# EAGLE design sous-vide-panel (EAGLE 7.6.0)
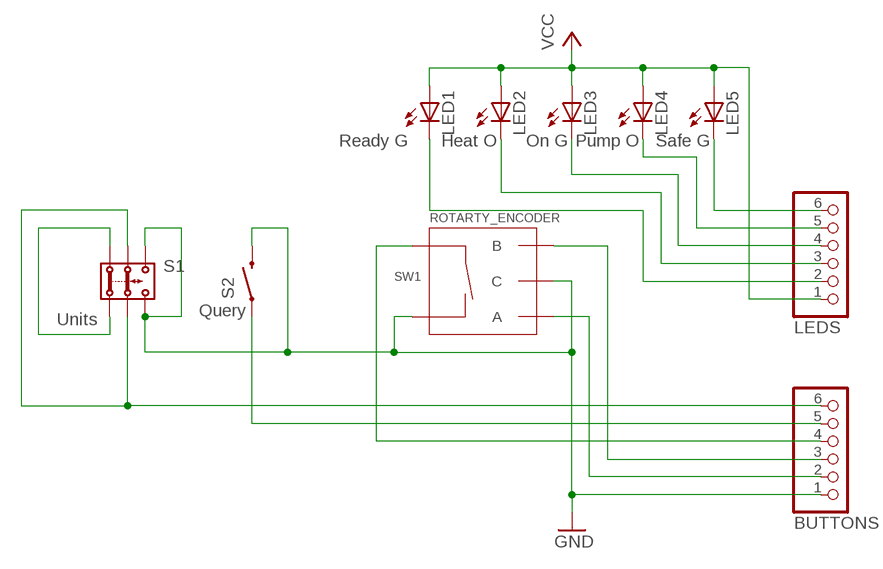
[diagram p0: schematic, sheet 1]

## Parts
BUTTONS  PINHD-1X6  [1X06]
LED1  Ready G  LED5MM  [LED5MM]
LED2  Heat O  LED5MM  [LED5MM]
LED3  On G  LED5MM  [LED5MM]
LED4  Pump O  LED5MM  [LED5MM]
LED5  Safe G  LED5MM  [LED5MM]
LEDS  PINHD-1X6  [1X06]
S1  Units  2P2T  [2P2T]
S2  Query  SWITCH-MOMENTARY-212MM  [TACTILE-PTH-12MM]
SW1  ROTARTY_ENCODER  [ROTARY_ENC_PLAIN]

## Nets
GND: BUTTONS.1 S1.3.1 S1.3.2 S2.3 SW1.C SW1.SW-
N$1: BUTTONS.6 S1.2.1 S1.2.2
N$2: BUTTONS.5 S2.1
N$3: BUTTONS.4 SW1.SW+
N$5: BUTTONS.3 SW1.B
N$6: LED5.K(C) LEDS.6
N$7: LED4.K(C) LEDS.5
N$8: BUTTONS.2 SW1.A
N$9: LED3.K(C) LEDS.4
N$10: LED2.K(C) LEDS.3
N$11: LED1.K(C) LEDS.2
N$13: S1.1.1 S1.1.2
VCC: LED1.A LED2.A LED3.A LED4.A LED5.A LEDS.1

## Library data of the parts
BUTTONS LEDS = pinhead:PINHD-1X6: PIN HEADER
LED1-LED5 = led:LED: LED OSRAM: - CHIPLED LG R971, LG N971, LY N971, LG Q971, LY Q971, LO R971, LY R971 LH N974, LH R974 LS Q976, LO Q976, LY Q976 LO Q996 - Hyper CHIPLED LW Q18S LB Q993, LB Q99A, LB R99A - SideLED LS A670, LO A670, LY A670, LG A670, LP A670 LB A673, LV A673, LT A673, LW A673 LH A674 LY A675 LS A676, LA A676, LO A676, LY A676, LW A676 LS A679, LY A679, LG A679 - Hyper Micro SIDELED® LS Y876, LA Y876, LO Y876, LY Y876 LT Y87S - SmartLED LW L88C, LW L88S LB L89C, LB L89S, LG L890 LS L89K, LO L89K, LY L89K LS L896, LA L896, LO L896, LY L896 - TOPLED LS T670, LO T670, LY T670, LG T670, LP T670 LSG T670, LSP T670, LSY T670, LOP T670, LYG T670 LG T671, LOG T671, LSG T671 LB T673, LV T673, LT T673, LW T673 LH T674 LS T676, LA T676, LO T676, LY T676, LB T676, LH T676, LSB T676, LW T676 LB T67C, LV T67C, LT T67C, LS T67K, LO T67K, LY T67K, LW E67C LS E67B, LA E67B, LO E67B, LY E67B, LB E67C, LV E67C, LT E67C LW T67C LS T679, LY T679, LG T679 LS T770, LO T770, LY T770, LG T770, LP T770 LB T773, LV T773, LT T773, LW T773 LH T774 LS E675, LA E675, LY E675, LS T675 LS T776, LA T776, LO T776, LY T776, LB T776 LHGB T686 LT T68C, LB T68C - Hyper Mini TOPLED® LB M676 - Mini TOPLED Santana® LG M470 LS M47K, LO M47K, LY M47K Source: http://www.osram.convergy.de LUXEON: - LUMILED® LXK2-PW12-R00, LXK2-PW12-S00, LXK2-PW14-U00, LXK2-PW14-V00 LXK2-PM12-R00, LXK2-PM12-S00, LXK2-PM14-U00 LXK2-PE12-Q00, LXK2-PE12-R00, LXK2-PE12-S00, LXK2-PE14-T00, LXK2-PE14-U00 LXK2-PB12-K00, LXK2-PB12-L00, LXK2-PB12-M00, LXK2-PB14-N00, LXK2-PB14-P00, LXK2-PB14-Q00 LXK2-PR12-L00, LXK2-PR12-M00, LXK2-PR14-Q00, LXK2-PR14-R00 LXK2-PD12-Q00, LXK2-PD12-R00, LXK2-PD12-S00 LXK2-PH12-R00, LXK2-PH12-S00 LXK2-PL12-P00, LXK2-PL12-Q00, LXK2-PL12-R00 Source: www.luxeon.com KINGBRIGHT: KA-3528ASYC Source: www.kingbright.com
S1 = switch:2P2T: SLIDE SWITCH 2P2T Part No. SS-22F05-G(A)4 Source: CANAL ELECTRONIC CO., LTD .. switsch.pdf
S2 = SparkFun-Electromechanical:SWITCH-MOMENTARY-2: Various NO switches- pushbuttons, reed, etc; PROD_ID: SWCH-09185
SW1 = SparkFun-Electromechanical:ROTARTY_ENCODER: Simple no LED rotary encoder Example: COM-09117

## Board
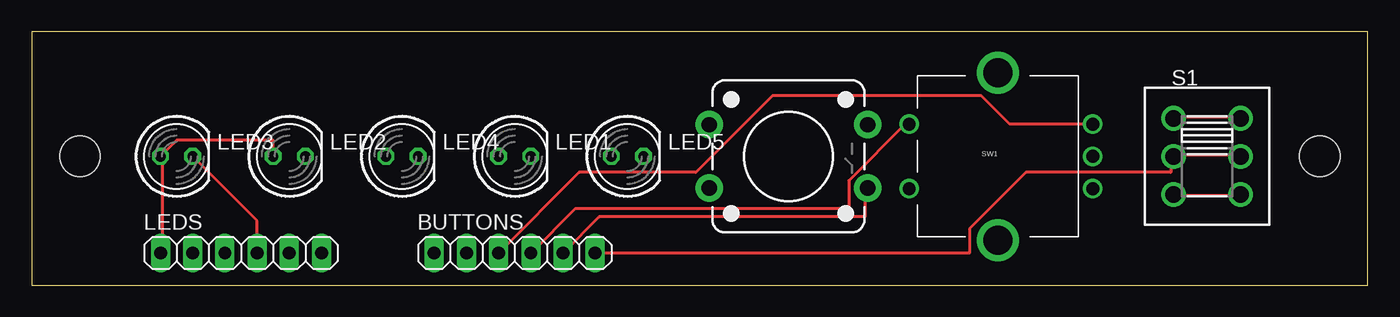
[diagram p1: board, top side]
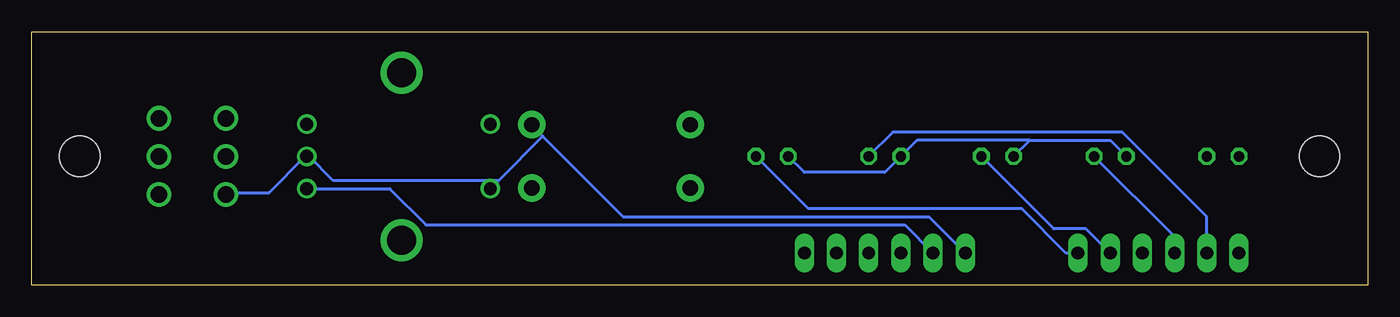
[diagram p2: board, bottom side, seen from below]

Size 105.39 x 19.99 mm. Coordinates in mm from the lower left corner, seen from the top.
Outline: 0,0 105.39,0 105.39,19.99 0,19.99 0,0
Copper layers (1*16): Top 0.035mm / dielectric 1.5mm / Bottom 0.035mm
Design rules "default": minimum track width 10mil, minimum drill 24mil, track to track 8mil, track to pad 8mil, pad to pad 8mil, via to via 8mil, smd to smd 8mil, copper to edge 40mil, drill to drill 8mil, minimum pad ring 10mil, minimum via ring 8mil, stop-mask expansion 4mil, vias tented up to drill 0mil, thermal gap 10mil
Holes 3.2 mm at 3.81,10.16 101.6,10.16

### Footprints (pad centres in the part's own frame; a part is rotated, then mirrored left to right if it is on the bottom)
1X06 = drill 1.016 long: 1 -6.35,0; 2 -3.81,0; 3 -1.27,0; 4 1.27,0; 5 3.81,0; 6 6.35,0
LED5MM = drill 0.813 octagon: A -1.27,0; K 1.27,0
2P2T = drill 1.3 pad 1.93: 1.1 -3,2.65; 1.2 -3,-2.65; 2.1 0,2.65; 2.2 0,-2.65; 3.1 3,2.65; 3.2 3,-2.65
TACTILE-PTH-12MM = drill 1.2 pad 2.159: 1 6.25,-2.5; 2 -6.25,-2.5; 3 6.25,2.5; 4 -6.25,2.5
ROTARY_ENC_PLAIN = drill 1.016: A 7.493,-2.54; B 7.493,2.54; C 7.493,0; SW+ -6.985,2.54; SW- -6.985,-2.54 | drill 2.286: P$3 0,6.604; P$4 0,-6.604

### Placement (x,y rotation side)
BUTTONS  38.1,2.54 0 top
LED1  38.1,10.16 0 top
LED2  20.32,10.16 0 top
LED3  11.43,10.16 0 top
LED4  29.21,10.16 0 top
LED5  46.99,10.16 0 top
LEDS  16.51,2.54 0 top
S1  92.71,10.16 270 top
S2  59.69,10.16 0 top
SW1  76.2,10.16 0 top

### Tracks (layer width: path | path; a pad name or v marks a point on that pad's centre or on a via)
GND
  Top 0.254: S1.3.1 95.33,7.09 90.07,7.09 S1.3.2
  Bottom 0.254: S1.3.2 89.85,7.3 86.68,7.3 83.82,10.16 SW1.C 83.5,10.16 81.6,8.26 68.58,8.26 | BUTTONS.1 34.61,5.4 58.74,5.4 65.09,11.75 | 65.09,11.75 65.72,12.38 S2.3 | 65.09,11.75 68.58,8.26 | 68.58,8.26 SW1.SW-
N$1
  Top 0.254: BUTTONS.6 73.98,2.54 73.98,4.45 78.42,8.89 89.85,8.89 89.85,10.16 S1.2.2 90.07,10.29 95.33,10.29 S1.2.1
N$2
  Top 0.254: BUTTONS.5 44.77,5.4 65.72,5.4 65.72,7.62 S2.1
N$3
  Top 0.254: BUTTONS.4 42.86,6.03 64.45,6.03 64.45,8.26 68.9,12.7 SW1.SW+
N$5
  Top 0.254: BUTTONS.3 43.18,8.89 52.39,8.89 58.42,14.92 74.93,14.92 77.15,12.7 SW1.B
N$6
  Bottom 0.254: LED5.K 44.13,6.03 27.3,6.03 23.81,2.54 LEDS.6
N$7
  Bottom 0.254: LED4.K 24.77,4.45 22.23,4.45 LEDS.5
N$8
  Bottom 0.254: BUTTONS.2 36.51,4.76 74.3,4.76 77.15,7.62 SW1.A
N$9
  Top 0.254: LED3.K 17.78,5.08 LEDS.4
N$10
  Bottom 0.254: LED2.K 15.24,3.81 LEDS.3
N$11
  Bottom 0.254: LED1.K 37.47,12.06 19.37,12.06 12.7,5.4 LEDS.2
N$13
  Top 0.254: S1.1.2 90.07,13.26 95.33,13.26 S1.1.1
VCC
  Top 0.254: LED2.A 19.05,11.43 11.43,11.43 LED3.A 10.29,10.06 10.29,2.74 LEDS.1
  Bottom 0.254: LED2.A 20.32,11.43 26.67,11.43 | LED4.A 26.67,11.43 | 26.67,11.43 35.56,11.43 LED1.A 38.1,8.89 44.45,8.89 LED5.A